# EAGLE schematic Schematic (EAGLE 9.7.0)
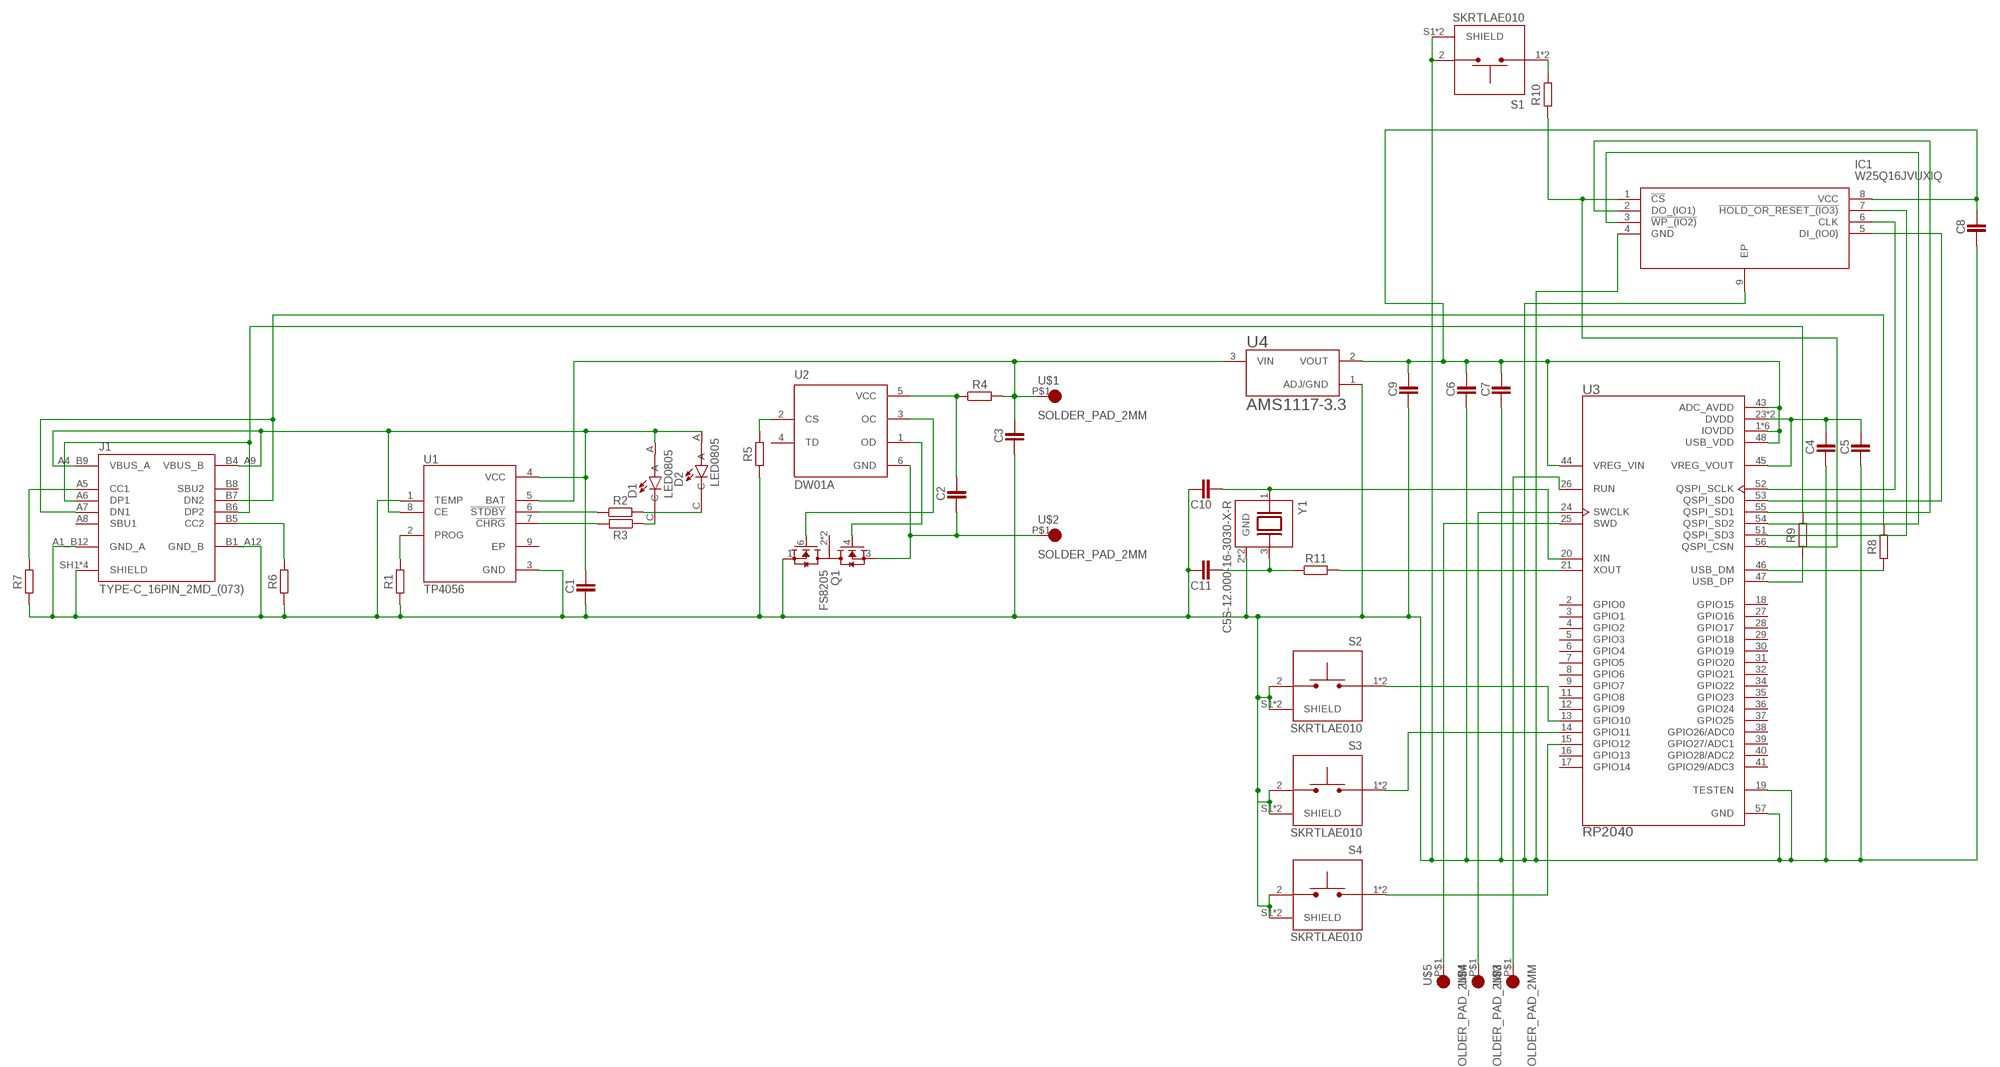
[diagram p0: schematic, sheet 1]

## Parts
C1  CAPACITOR_CHIP-0805(2012-METRIC)  [CAPC2012X110]
C2  CAPACITOR_CHIP-0805(2012-METRIC)  [CAPC2012X110]
C3  CAPACITOR_CHIP-0805(2012-METRIC)  [CAPC2012X110]
C4  CAPACITOR_CHIP-0805(2012-METRIC)  [CAPC2012X110]
C5  CAPACITOR_CHIP-0805(2012-METRIC)  [CAPC2012X110]
C6  CAPACITOR_CHIP-0805(2012-METRIC)  [CAPC2012X110]
C7  CAPACITOR_CHIP-0805(2012-METRIC)  [CAPC2012X110]
C8  CAPACITOR_CHIP-0805(2012-METRIC)  [CAPC2012X110]
C9  CAPACITOR_CHIP-0805(2012-METRIC)  [CAPC2012X110]
C10  CAPACITOR_CHIP-0805(2012-METRIC)  [CAPC2012X110]
C11  CAPACITOR_CHIP-0805(2012-METRIC)  [CAPC2012X110]
D1  LED0805  [LEDC2012X70N]
D2  LED0805  [LEDC2012X70N]
IC1  W25Q16JVUXIQ  [SON50P300X200X60-9N]
J1  TYPE-C_16PIN_2MD_(073)  [SHOUHAN_TYPE-C_16PIN_2MD_(073)]
Q1  FS8205  [SOT95P280X145-6N]
R1  RESISTOR__CHIP-0805(2012-METRIC)  [RESC2012X65]
R2  RESISTOR__CHIP-0805(2012-METRIC)  [RESC2012X65]
R3  RESISTOR__CHIP-0805(2012-METRIC)  [RESC2012X65]
R4  RESISTOR__CHIP-0805(2012-METRIC)  [RESC2012X65]
R5  RESISTOR__CHIP-0805(2012-METRIC)  [RESC2012X65]
R6  RESISTOR__CHIP-0805(2012-METRIC)  [RESC2012X65]
R7  RESISTOR__CHIP-0805(2012-METRIC)  [RESC2012X65]
R8  RESISTOR__CHIP-0805(2012-METRIC)  [RESC2012X65]
R9  RESISTOR__CHIP-0805(2012-METRIC)  [RESC2012X65]
R10  RESISTOR__CHIP-0805(2012-METRIC)  [RESC2012X65]
R11  RESISTOR__CHIP-0805(2012-METRIC)  [RESC2012X65]
S1  SKRTLAE010  [SW_SKRTLAE010]
S2  SKRTLAE010  [SW_SKRTLAE010]
S3  SKRTLAE010  [SW_SKRTLAE010]
S4  SKRTLAE010  [SW_SKRTLAE010]
U1  TP4056  [SOP127P600X175-9N]
U2  DW01A  [SOT95P280X145-6N]
U3  RP2040  [QFN40P700X700X90-57N]
U4  AMS1117-3.3  [SOT229P700X180-4N]
U$1  SOLDER_PAD_2MM  [SOLDER_PAD_2MM]
U$2  SOLDER_PAD_2MM  [SOLDER_PAD_2MM]
U$3  SOLDER_PAD_2MM  [SOLDER_PAD_2MM]
U$4  SOLDER_PAD_2MM  [SOLDER_PAD_2MM]
U$5  SOLDER_PAD_2MM  [SOLDER_PAD_2MM]
Y1  C5S-12.000-16-3030-X-R  [XTAL_C5S-12.000-16-3030-X-R]

## Nets
N$1: C11.2 R11.1 Y1.3
N$2: R1.2 U1.2(PROG)
N$3: C1.1 D1.A D2.A J1.A4_B9(VBUS_A) J1.B4_A9(VBUS_B) U1.4(VCC) U1.8(CE)
N$4: D1.C R3.1
N$5: D2.C R2.2
N$6: R2.1 U1.6(!STDBY)
N$7: R3.2 U1.7(!CHRG)
N$8: C2.2 Q1.3(S2) U2.6(GND) U$2.P$1
N$9: Q1.4(G2) U2.1(OD)
N$10: Q1.6(G1) U2.3(OC)
N$11: J1.A5(CC1) R7.2
N$12: C2.1 R4.1 U2.5(VCC)
N$13: R5.2 U2.2(CS)
N$14: C3.1 R4.2 U1.5(BAT) U4.3(VIN) U$1.P$1
N$15: J1.B5(CC2) R6.2
N$16: R11.2 U3.21(XOUT)
N$17: C4.1 C5.1 U3.23(DVDD) U3.45(VREG_VOUT) U3.50(DVDD)
N$18: J1.A6(DP1) J1.B6(DP2) R9.2
N$19: J1.A7(DN1) J1.B7(DN2) R8.2
N$20: R9.1 U3.47(USB_DP)
N$21: R8.1 U3.46(USB_DM)
N$22: IC1.6(CLK) U3.52(QSPI_SCLK)
N$23: IC1.7(!HOLD_OR_RESET_(IO3)) U3.51(QSPI_SD3)
N$24: IC1.3(!WP_(IO2)) U3.54(QSPI_SD2)
N$25: IC1.2(DO_(IO1)) U3.55(QSPI_SD1)
N$26: IC1.5(DI_(IO0)) U3.53(QSPI_SD0)
N$27: C6.1 C7.1 C8.1 C9.1 IC1.8(VCC) U3.1(IOVDD) U3.10(IOVDD) U3.22(IOVDD) U3.33(IOVDD) U3.42(IOVDD) U3.43(ADC_AVDD) U3.44(VREG_VIN) U3.48(USB_VDD) U3.49(IOVDD) U4.2(VOUT)
N$28: R10.2 S1.1 S1.3
N$29: IC1.1(!CS) R10.1 U3.56(QSPI_CSN)
N$30: C1.2 C3.2 C4.2 C5.2 C6.2 C7.2 C8.2 C9.2 C10.1 C11.1 IC1.4(GND) IC1.9(EP) J1.A1_B12(GND_A) J1.B1_A12(GND_B) J1.SH1(SHIELD) J1.SH2(SHIELD) J1.SH3(SHIELD) J1.SH4(SHIELD) Q1.1(S1) R1.1 R5.1 R6.1 R7.1 S1.2 S1.S1(SHIELD) S1.S2(SHIELD) S2.2 S2.S1(SHIELD) S2.S2(SHIELD) S3.2 S3.S1(SHIELD) S3.S2(SHIELD) S4.2 S4.S1(SHIELD) S4.S2(SHIELD) U1.1(TEMP) U1.3(GND) U3.19(TESTEN) U3.57(GND) U4.1(ADJ/GND) Y1.2(GND) Y1.4(GND)
N$31: C10.2 U3.20(XIN) Y1.1
N$32: S2.1 S2.3 U3.13(GPIO10)
N$33: S3.1 S3.3 U3.14(GPIO11)
N$34: S4.1 S4.3 U3.15(GPIO12)
N$35: U3.26(RUN) U$3.P$1
N$36: U3.24(SWCLK) U$4.P$1
N$37: U3.25(SWD) U$5.P$1
Unconnected: J1.A8(SBU1) J1.B8(SBU2) Q1.2(D12) Q1.5(D12) U1.9(EP) U2.4(TD) U3.2(GPIO0) U3.3(GPIO1) U3.4(GPIO2) U3.5(GPIO3) U3.6(GPIO4) U3.7(GPIO5) U3.8(GPIO6) U3.9(GPIO7) U3.11(GPIO8) U3.12(GPIO9) U3.16(GPIO13) U3.17(GPIO14) U3.18(GPIO15) U3.27(GPIO16) U3.28(GPIO17) U3.29(GPIO18) U3.30(GPIO19) U3.31(GPIO20) U3.32(GPIO21) U3.34(GPIO22) U3.35(GPIO23) U3.36(GPIO24) U3.37(GPIO25) U3.38(GPIO26/ADC0) U3.39(GPIO27/ADC1) U3.40(GPIO28/ADC2) U3.41(GPIO29/ADC3)

## Library data of the parts
C1-C11 = Tinkercad:CAPACITOR: Capacitor - Generic
D1 D2 = LED 0805:LED0805: Check availability <https://pricing.snapeda.com/parts/597-3305-607F/Dialight/view-part?ref=eda>
IC1 = W25Q16JVUXIQ:W25Q16JVUXIQ: Check availability <https://pricing.snapeda.com/parts/W25Q16JVUXIQ/Winbond/view-part?ref=eda>
J1 = TYPE-C_16PIN_2MD__073_:TYPE-C_16PIN_2MD_(073): Check availability <https://pricing.snapeda.com/parts/TYPE-C%2016PIN%202MD%20%28073%29/Shouhan/view-part?ref=eda>
Q1 = TP4056:FS8205: Check availability <https://pricing.snapeda.com/parts/FS8205/Fortune%20Semiconductor/view-part?ref=eda>
R1-R11 = Tinkercad:RESISTOR: Resistor Fixed - Generic
S1-S4 = SKRTLAE010:SKRTLAE010: Check availability <https://pricing.snapeda.com/parts/SKRTLAE010/ALPS/view-part?ref=eda>
U1 = TP4056:TP4056: Check availability <https://pricing.snapeda.com/parts/TP4056/NanJing%20Top%20Power%20ASIC%20Corp./view-part?ref=eda>
U2 = DW01A:DW01A: Check availability <https://pricing.snapeda.com/parts/DW01A/Fortune%20Semiconductor/view-part?ref=eda>
U3 = RP2040:RP2040: Check availability <https://pricing.snapeda.com/parts/RP2040/Raspberry%20Pi/view-part?ref=eda>
U4 = AMS1117-3:AMS1117-3.3: Check availability <https://pricing.snapeda.com/parts/AMS1117-3.3/UMW/view-part?ref=eda>
U$1-U$5 = Library:SOLDER_PAD_2MM
Y1 = C5S-12.000-16-3030-X-R:C5S-12.000-16-3030-X-R: Check availability <https://pricing.snapeda.com/parts/C5S-12.000-16-3030-X-R/Aker%20Technology%20USA/view-part?ref=eda>